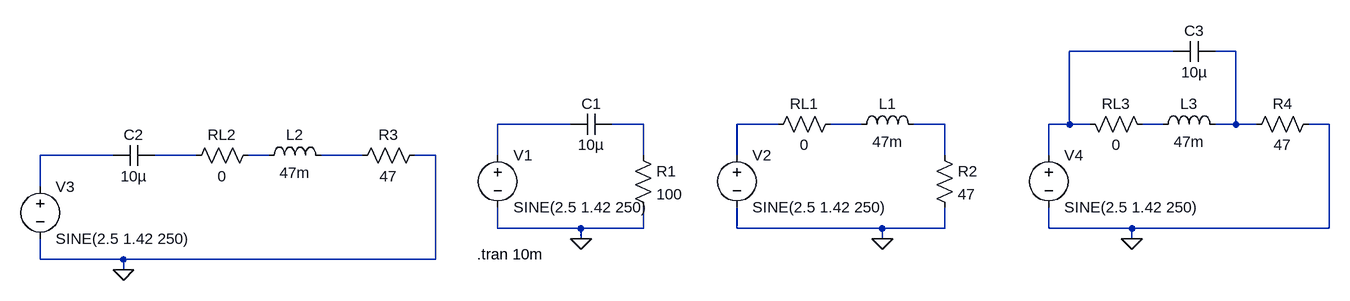
[diagram p0: schematic power_factor_ltspice.asc]
power_factor_ltspice.asc, the LTspice schematic file:
Version 4
SHEET 1 1252 680
WIRE 960 -32 800 -32
WIRE 1056 -32 1024 -32
WIRE 32 80 -80 80
WIRE 144 80 96 80
WIRE 352 80 288 80
WIRE 480 80 432 80
WIRE 608 80 560 80
WIRE 800 80 800 -32
WIRE 800 80 768 80
WIRE 832 80 800 80
WIRE 944 80 912 80
WIRE 1056 80 1056 -32
WIRE 1056 80 1024 80
WIRE 1088 80 1056 80
WIRE 1200 80 1168 80
WIRE -672 128 -784 128
WIRE -544 128 -608 128
WIRE -432 128 -464 128
WIRE -288 128 -352 128
WIRE -176 128 -208 128
WIRE -80 128 -80 80
WIRE 144 128 144 80
WIRE 288 128 288 80
WIRE 608 128 608 80
WIRE 768 128 768 80
WIRE -784 176 -784 128
WIRE -80 240 -80 208
WIRE 48 240 -80 240
WIRE 144 240 144 208
WIRE 144 240 48 240
WIRE 288 240 288 208
WIRE 512 240 288 240
WIRE 608 240 608 208
WIRE 608 240 512 240
WIRE 768 240 768 208
WIRE 896 240 768 240
WIRE 1200 240 1200 80
WIRE 1200 240 896 240
WIRE 48 256 48 240
WIRE 512 256 512 240
WIRE 896 256 896 240
WIRE -784 288 -784 256
WIRE -656 288 -784 288
WIRE -176 288 -176 128
WIRE -176 288 -656 288
WIRE -656 304 -656 288
FLAG 48 256 0
FLAG 512 256 0
FLAG -656 304 0
FLAG 896 256 0
SYMBOL cap 96 64 R90
WINDOW 0 0 32 VBottom 2
WINDOW 3 32 32 VTop 2
SYMATTR InstName C1
SYMATTR Value 10µ
SYMBOL voltage -80 112 R0
WINDOW 123 0 0 Left 0
WINDOW 39 0 0 Left 0
SYMATTR InstName V1
SYMATTR Value SINE(2.5 1.42 250)
SYMBOL res 128 112 R0
SYMATTR InstName R1
SYMATTR Value 100
SYMBOL voltage 288 112 R0
WINDOW 123 0 0 Left 0
WINDOW 39 0 0 Left 0
SYMATTR InstName V2
SYMATTR Value SINE(2.5 1.42 250)
SYMBOL res 592 112 R0
SYMATTR InstName R2
SYMATTR Value 47
SYMBOL ind 464 96 R270
WINDOW 0 32 56 VTop 2
WINDOW 3 5 56 VBottom 2
SYMATTR InstName L1
SYMATTR Value 47m
SYMBOL cap -608 112 R90
WINDOW 0 0 32 VBottom 2
WINDOW 3 32 32 VTop 2
SYMATTR InstName C2
SYMATTR Value 10µ
SYMBOL voltage -784 160 R0
WINDOW 123 0 0 Left 0
WINDOW 39 0 0 Left 0
SYMATTR InstName V3
SYMATTR Value SINE(2.5 1.42 250)
SYMBOL res -192 112 R90
WINDOW 0 0 56 VBottom 2
WINDOW 3 32 56 VTop 2
SYMATTR InstName R3
SYMATTR Value 47
SYMBOL ind -448 144 R270
WINDOW 0 32 56 VTop 2
WINDOW 3 5 56 VBottom 2
SYMATTR InstName L2
SYMATTR Value 47m
SYMBOL cap 1024 -48 R90
WINDOW 0 0 32 VBottom 2
WINDOW 3 32 32 VTop 2
SYMATTR InstName C3
SYMATTR Value 10µ
SYMBOL voltage 768 112 R0
WINDOW 123 0 0 Left 0
WINDOW 39 0 0 Left 0
SYMATTR InstName V4
SYMATTR Value SINE(2.5 1.42 250)
SYMBOL res 1184 64 R90
WINDOW 0 0 56 VBottom 2
WINDOW 3 32 56 VTop 2
SYMATTR InstName R4
SYMATTR Value 47
SYMBOL ind 928 96 R270
WINDOW 0 32 56 VTop 2
WINDOW 3 5 56 VBottom 2
SYMATTR InstName L3
SYMATTR Value 47m
SYMBOL res -448 112 R90
WINDOW 0 0 56 VBottom 2
WINDOW 3 32 56 VTop 2
SYMATTR InstName RL2
SYMATTR Value 0
SYMBOL res 448 64 R90
WINDOW 0 0 56 VBottom 2
WINDOW 3 32 56 VTop 2
SYMATTR InstName RL1
SYMATTR Value 0
SYMBOL res 816 64 M90
WINDOW 0 0 56 VBottom 2
WINDOW 3 32 56 VTop 2
SYMATTR InstName RL3
SYMATTR Value 0
TEXT -112 280 Left 2 !.tran 10m

The netlist it stands for:
* power_factor_ltspice.asc
C1 N004 N003 10µ
V1 N003 0 SINE(2.5 1.42 250)
R1 N004 0 100
V2 N005 0 SINE(2.5 1.42 250)
R2 N007 0 47
L1 N006 N007 47m
C2 N010 N009 10µ
V3 N009 0 SINE(2.5 1.42 250)
R3 0 N012 47
L2 N011 N012 47m
C3 N002 N001 10µ
V4 N001 0 SINE(2.5 1.42 250)
R4 0 N002 47
L3 N008 N002 47m
RL2 N011 N010 0
RL1 N006 N005 0
RL3 N001 N008 0
.tran 10m
.backanno
.end